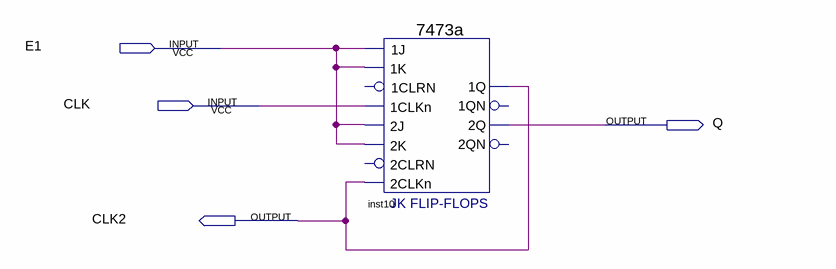
[diagram p0: schematic sheet]
// Quartus schematic cascada_JK.bdf as structural Verilog: 1 symbols, 4 pins
module cascada_JK (
  input  E1,
  input  CLK,
  output Q,
  output CLK2
);

  \7473a  inst10 (
    .\1CLKn (CLK), .\2J (E1), .\1K (E1), .\2CLKn (CLK2), .\2K (E1), .\1J (E1), .\2Q (Q), .\1Q (CLK2));  // open: 1CLRN, 2CLRN, 1QN, 2QN
endmodule
